# EAGLE schematic ME433_proto_board (EAGLE 5.12)
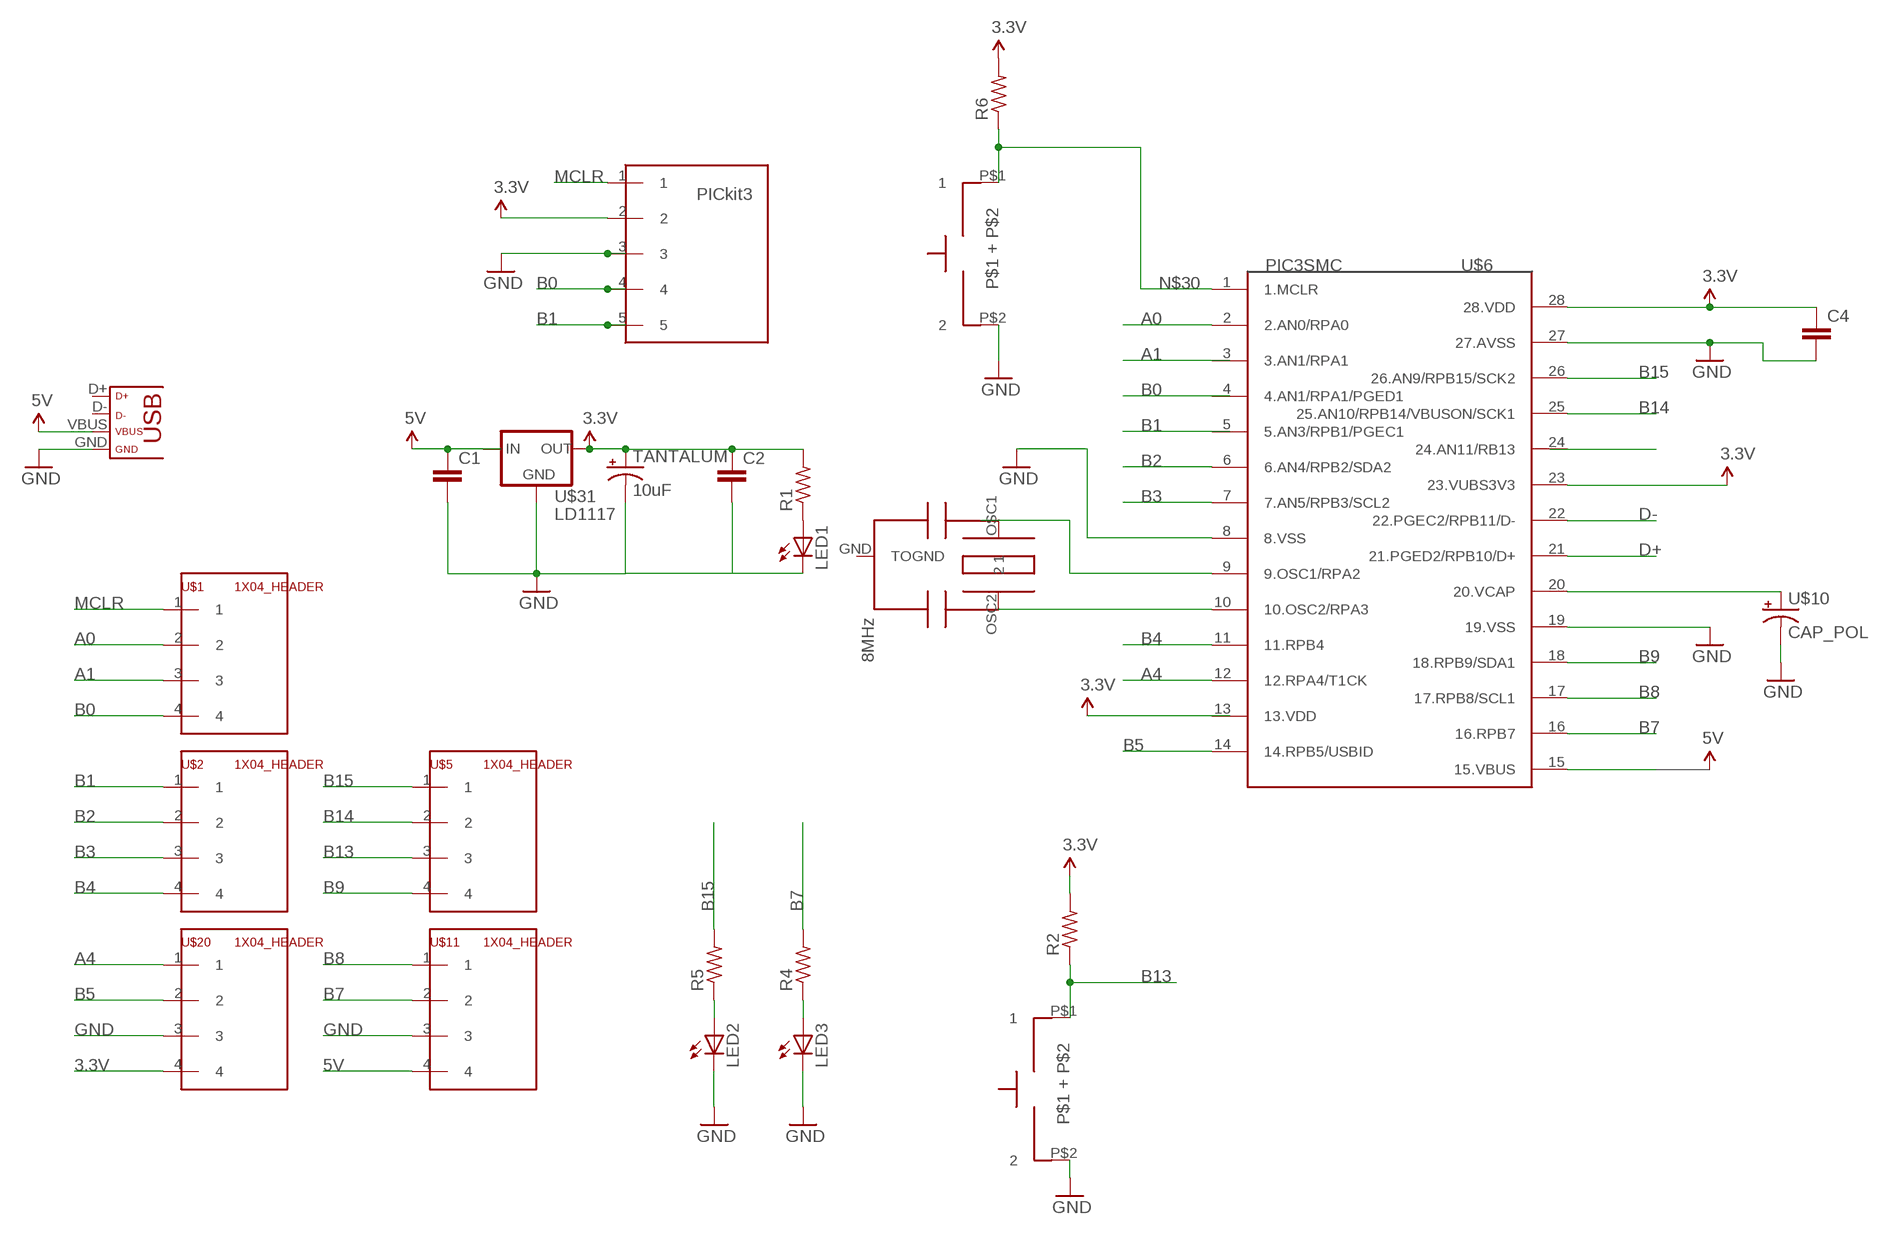
[diagram p0: schematic, sheet 1]

## Parts
C1  C-EU025-024X044  [C025-024X044]
C2  C-EU025-024X044  [C025-024X044]
C4  C-EU025-024X044  [C025-024X044]
LED1  LED  [SMARTLED-TTW]
LED2  LED  [SMARTLED-TTW]
LED3  LED  [SMARTLED-TTW]
R1  R-US_0204/2V  [0204V]
R2  R-US_0204/2V  [0204V]
R4  R-US_0204/2V  [0204V]
R5  R-US_0204/2V  [0204V]
R6  R-US_0204/2V  [0204V]
TANTALUM  10uF  CAP_POL  [CAP_POL_D]
U$1  1X04_HEADER  [1X04]
U$2  1X04_HEADER  [1X04]
U$5  1X04_HEADER  [1X04]
U$6  PIC3SMC  [PIC32]
U$7  8MHZRES  [8MHZRES]
U$8  2-LEADBUTTONPUSH  [2-LEADBUTTONPUSH]
U$9  2-LEADBUTTONPUSH  [2-LEADBUTTONPUSH]
U$10  CAP_POL  [CAP_POL_D]
U$11  1X04_HEADER  [1X04]
U$16  PICKIT3  [PICKIT3]
U$20  1X04_HEADER  [1X04]
U$29  USB  [USB-MINIB]
U$31  LD1117  [TO220]

## Nets
3.3V: C2.1 R1.2 R2.2 R6.2 TANTALUM.1(+) U$20.4 U$31.2(OUT)
5V: C1.1 U$11.4 U$29.VBUS
A0: U$1.2 U$6.2(2.AN0/RPA0)
A1: U$1.3
A4: U$6.12(12.RPA4/T1CK) U$20.1
B0: U$1.4 U$16.4
B1: U$2.1 U$16.5
B2: U$2.2 U$6.6(6.AN4/RPB2/SDA2)
B3: U$2.3 U$6.7(7.AN5/RPB3/SCL2)
B4: U$2.4 U$6.11(11.RPB4)
B5: U$6.14(14.RPB5/USBID) U$20.2
B7: R4.2 U$6.16(16.RPB7) U$11.2
B8: U$6.17(17.RPB8/SCL1) U$11.1
B9: U$5.4 U$6.18(18.RPB9/SDA1)
B13: R2.1 U$5.3 U$9.P$1
B14: U$5.2 U$6.25(25.AN10/RPB14/VBUSON/SCK1)
B15: R5.2 U$5.1 U$6.26(26.AN9/RPB15/SCK2)
D+: U$6.21(21.PGED2/RPB10/D+)
D-: U$6.22(22.PGEC2/RPB11/D-)
GND: C1.2 C2.2 LED1.C@1(C) LED2.C@1(C) LED3.C@1(C) TANTALUM.2(-) U$9.P$2 U$10.2(-) U$11.3 U$20.3 U$29.GND U$31.1(GND)
MCLR: U$1.1 U$16.1
N$1: C4.1 U$6.28(28.VDD) ; supply symbol labelled 3.3V
N$2: C4.2 U$6.27(27.AVSS) ; supply symbol labelled GND
N$4: U$16.2 ; supply symbol labelled 3.3V
N$5: U$16.3 ; supply symbol labelled GND
N$6: U$6.23(23.VUBS3V3) ; supply symbol labelled 3.3V
N$9: U$6.20(20.VCAP) U$10.1(+)
N$10: U$6.19(19.VSS) ; supply symbol labelled GND
N$14: U$6.15(15.VBUS)
N$22: U$6.8(8.VSS) ; supply symbol labelled GND
N$23: U$6.9(9.OSC1/RPA2)
N$24: U$6.10(10.OSC2/RPA3) U$7.OSC2
N$29: U$8.P$2 ; supply symbol labelled GND
N$30: R6.1 U$6.1(1.MCLR) U$8.P$1
N$40: LED1.A@1(A) R1.1
N$56: LED2.A@1(A) R5.1
N$57: LED3.A@1(A) R4.1
Unconnected: U$6.3(3.AN1/RPA1) U$6.4(4.AN1/RPA1/PGED1) U$6.5(5.AN3/RPB1/PGEC1) U$6.13(13.VDD) U$6.24(24.AN11/RB13) U$7.GND(TOGND) U$7.OSC1 U$29.D+ U$29.D- U$31.3(IN)

## Library data of the parts
C1 C2 C4 = resistor:C-EU: CAPACITOR, European symbol
LED1-LED3 = led:LED: LED OSRAM: - CHIPLED LG R971, LG N971, LY N971, LG Q971, LY Q971, LO R971, LY R971 LH N974, LH R974 LS Q976, LO Q976, LY Q976 LO Q996 - Hyper CHIPLED LW Q18S LB Q993, LB Q99A, LB R99A - SideLED LS A670, LO A670, LY A670, LG A670, LP A670 LB A673, LV A673, LT A673, LW A673 LH A674 LY A675 LS A676, LA A676, LO A676, LY A676, LW A676 LS A679, LY A679, LG A679 - Hyper Micro SIDELED® LS Y876, LA Y876, LO Y876, LY Y876 LT Y87S - SmartLED LW L88C, LW L88S LB L89C, LB L89S, LG L890 LS L89K, LO L89K, LY L89K LS L896, LA L896, LO L896, LY L896 - TOPLED LS T670, LO T670, LY T670, LG T670, LP T670 LSG T670, LSP T670, LSY T670, LOP T670, LYG T670 LG T671, LOG T671, LSG T671 LB T673, LV T673, LT T673, LW T673 LH T674 LS T676, LA T676, LO T676, LY T676, LB T676, LH T676, LSB T676, LW T676 LB T67C, LV T67C, LT T67C, LS T67K, LO T67K, LY T67K, LW E67C LS E67B, LA E67B, LO E67B, LY E67B, LB E67C, LV E67C, LT E67C LW T67C LS T679, LY T679, LG T679 LS T770, LO T770, LY T770, LG T770, LP T770 LB T773, LV T773, LT T773, LW T773 LH T774 LS E675, LA E675, LY E675, LS T675 LS T776, LA T776, LO T776, LY T776, LB T776 LHGB T686 LT T68C, LB T68C - Hyper Mini TOPLED® LB M676 - Mini TOPLED Santana® LG M470 LS M47K, LO M47K, LY M47K Source: http://www.osram.convergy.de LUXEON: - LUMILED® LXK2-PW12-R00, LXK2-PW12-S00, LXK2-PW14-U00, LXK2-PW14-V00 LXK2-PM12-R00, LXK2-PM12-S00, LXK2-PM14-U00 LXK2-PE12-Q00, LXK2-PE12-R00, LXK2-PE12-S00, LXK2-PE14-T00, LXK2-PE14-U00 LXK2-PB12-K00, LXK2-PB12-L00, LXK2-PB12-M00, LXK2-PB14-N00, LXK2-PB14-P00, LXK2-PB14-Q00 LXK2-PR12-L00, LXK2-PR12-M00, LXK2-PR14-Q00, LXK2-PR14-R00 LXK2-PD12-Q00, LXK2-PD12-R00, LXK2-PD12-S00 LXK2-PH12-R00, LXK2-PH12-S00 LXK2-PL12-P00, LXK2-PL12-Q00, LXK2-PL12-R00 Source: www.luxeon.com KINGBRIGHT: KA-3528ASYC Source: www.kingbright.com
R1 R2 R4-R6 = resistor:R-US_: RESISTOR, American symbol
TANTALUM U$10 = ME433:CAP_POL
U$1 U$2 U$5 U$11 U$20 = ME433:1X04_HEADER
U$6 = advanced_mechatronics_library:PIC3SMC
U$7 = advanced_mechatronics_library:8MHZRES
U$8 U$9 = advanced_mechatronics_library:2-LEADBUTTONPUSH
U$16 = advanced_mechatronics_library:PICKIT3
U$29 = ME433:USB
U$31 = ME433:LD1117